# Altium schematic sheet Title.SchDoc: =DT_SCH_Title
size A3; Revision: 1.0; SheetNumber: 1; SheetTotal: 2
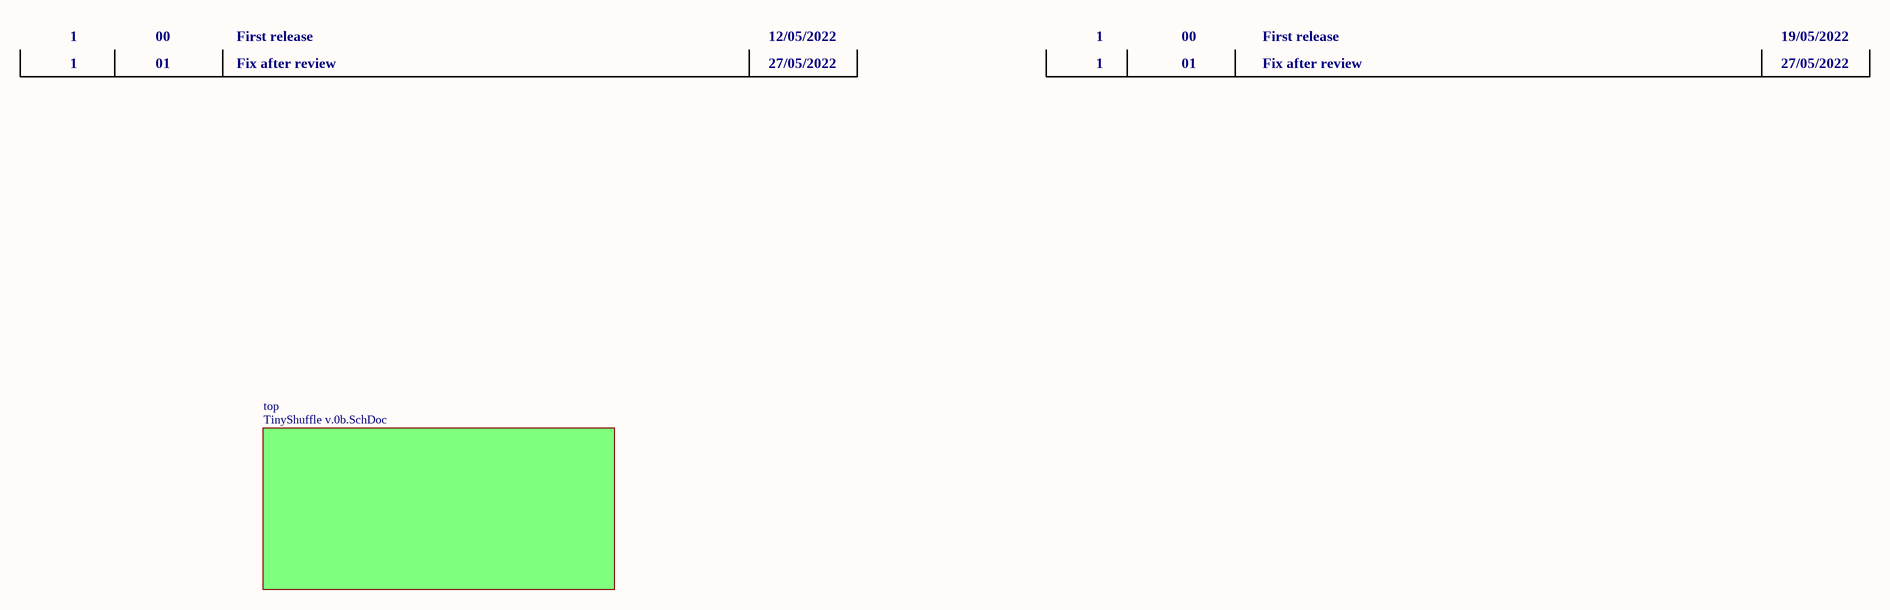
[diagram p0: Title.SchDoc]

## Sub-sheets
top = TinyShuffle v.0b.SchDoc: no entries

## Notes on the sheet
- 1
- 00
- 01
- First release
- Fix after review
- 12/05/2022
- 27/05/2022
- 19/05/2022
- SCH (PCBA) Part Number:
- PCB Part Number:
- REVISION
- SUBREVISION
- SCHEMATIC MAJOR REVISION HISTORY
- CHANGE DESCRIPTION
- DD/MM/YY
- PCB MAJOR REVISION HISTORY
- Title
- Size:
- A3
- Number:
- Revision:
- Date:
- Time:
- Sheet
- of